# Altium project F-T-V Converter.PrjPcb
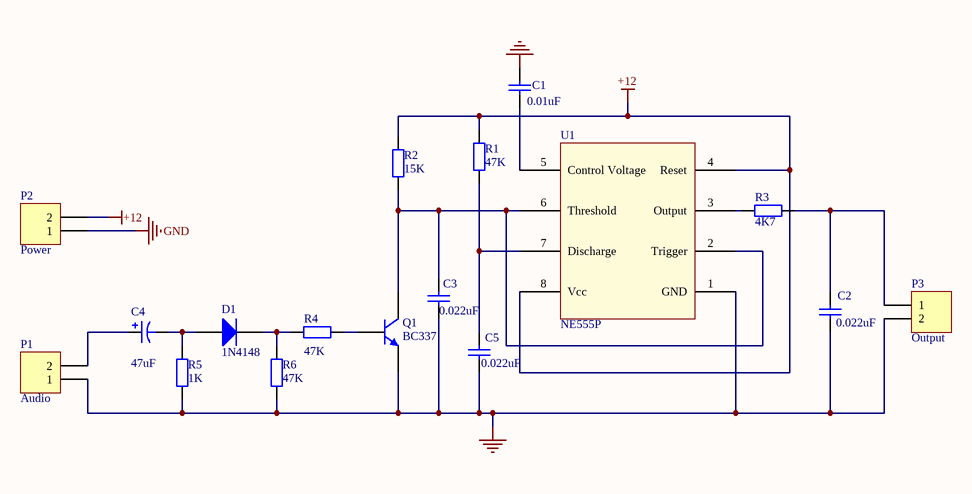
[diagram p0: F-T-V_Converter_Schematic.SchDoc]
1 sheet, 17 parts. Net scope: global (net labels, ports and power ports of the same name join across sheets).
Board file: F-T-V Converter PCB.PcbDoc

## Sheet F-T-V_Converter_Schematic.SchDoc
size A

### Parts
C1  value 0.01uF  [RAD-0.1]
C2  value 0.022uF  [RAD-0.1]
C3  value 0.022uF  [RAD-0.1]
C4  value 47uF  [RB7.6-15]
C5  value 0.022uF  [RAD-0.1]
D1  1N4148  [DO-35]
P1  Audio  [HDR1X2]
P2  Power  [HDR1X2]
P3  Output  [HDR1X2]
Q1  BC337  [TO-92]
R1  value 47K  [AXIAL-0.4]  (hidden comment: Res2)
R2  value 15K  [AXIAL-0.4]  (hidden comment: Res2)
R3  4K7  [AXIAL-0.4]
R4  value 47K  [AXIAL-0.4]  (hidden comment: Res2)
R5  value 1K  [AXIAL-0.4]
R6  value 47K  [AXIAL-0.4]  (hidden comment: Res2)
U1  NE555P  [NE555]

### Nets
+12: P2.2 R1.2 R2.2 U1.4(Reset) U1.8(Vcc)
GND: C1.2 C2.1 C3.1 C5.1 P1.1 P2.1 P3.2 Q1.3(E) R5.1 R6.1 U1.1(GND)
NetC1_1: C1.1 U1.5(Control_Voltage)
NetC2_2: C2.2 P3.1 R3.2
NetC3_2: C3.2 Q1.1(C) R2.1 U1.2(Trigger) U1.6(Threshold)
NetC4_1: C4.1 P1.2
NetC4_2: C4.2 D1.1(A) R5.2
NetC5_2: C5.2 R1.1 U1.7(Discharge)
NetD1_2: D1.2(K) R4.1 R6.2
NetQ1_2: Q1.2(B) R4.2
NetR3_1: R3.1 U1.3(Output)

### Library data of the parts
C1 = Cap: Capacitor: ceramic; MLCC, monolithic; 10nF; 100V; X7R; ±10%; THT; Manufacturer: KEMET; Manufacturer Part Number: C315C103K1R5TA; Dissipation Factor: 2.5%; Lead/Base Style: Straight; Lead Length: 7mm; Lead Diameter: 0.51mm; Published: 8-Jun-2000; LatestRevisionDate: 17-Jul-2002; LatestRevisionNote: Re-released for DXP Platform.; PackageReference: RAD-0.3; Publisher: Altium Limited; PackageDescription: Radial Cap, Thru-Hole; 2 Leads; 0.3 in Pin Spacing; Supplier 1: Digi-Key; Supplier Part Number 1: 399-4147-ND; RoHS: Yes; Category: Ceramic Capacitors; Stock 1: 32763; Pricing 1: 1=0.26000, 10=0.17800, 50=0.11880, 100=0.10100, 500=0.07128, 1000=0.06237, 2500=0.05940, 5000=0.05494 (USD); Mount: Through Hole,PCB; Case/Package: Radial; Number of Pins: 2; Dielectric Material: Ceramic; Min Operating Temperature: -55°C; Max Operating Temperature: 125°C; Capacitance: 10nF; Tolerance: 10%; Packaging: Bulk; Dielectric: X7R; Voltage Rating (DC): 100V; Voltage Rating: 100V; Package Quantity: 2500; Termination: Radial; Voltage: 100V; Series: GoldMax 300 Comm X7R; Construction: RADIAL; Length: 3.81mm; Width: 3.81mm; Height: 2.54mm; Lead Pitch: 2.54mm; Height - Seated (Max): 0.21inch; Depth: 2.54mm; Radiation Hardening: No; REACH SVHC: No SVHC; Lead Free: Lead Free; RoHS Compliant: Yes; ComponentLink1URL: https://datasheet.ciiva.com/11786/0900766b80717e24-11786801.pdf?src-supplier=RSComponents; ComponentLink1Description: https://datasheet.ciiva.com/11786/0900766b80717e24-11786801.pdf?src-supplier=RSComponents; ComponentLink2URL: https://datasheet.ciiva.com/5904/f3101-goldmax-5904939.pdf?src-supplier=Farnell; ComponentLink2Description: https://datasheet.ciiva.com/5904/f3101-goldmax-5904939.pdf?src-supplier=Farnell; ComponentLink3URL: https://datasheet.ciiva.com/18102/getdatasheetpartid-77390-18102811.pdf?src-supplier=Verical; ComponentLink3Description: https://datasheet.ciiva.com/18102/getdatasheetpartid-77390-18102811.pdf?src-supplier=Verical; ComponentLink4URL: https://datasheet.ciiva.com/39122/f3101-goldmax-39122972.pdf?src-supplier=Onlinecomponents.com; ComponentLink4Description: https://datasheet.ciiva.com/39122/f3101-goldmax-39122972.pdf?src-supplier=Onlinecomponents.com; ComponentLink5URL: https://datasheet.ciiva.com/5389/f3101-goldmax-5389838.pdf?src-supplier=Mouser; ComponentLink5Description: https://datasheet.ciiva.com/5389/f3101-goldmax-5389838.pdf?src-supplier=Mouser
C2 C3 C5 = Cap: Cap Ceramic 0.022uF 50V Z5U 20% Radial 5.08mm 85C T/R; Manufacturer: KEMET; Manufacturer Part Number: C317C223M5U5TA7301; Capacitance: 22nF; Lead/Base Style: Formed Leads; Published: 8-Jun-2000; LatestRevisionDate: 17-Jul-2002; LatestRevisionNote: Re-released for DXP Platform.; PackageReference: RAD-0.3; Publisher: Altium Limited; PackageDescription: Radial Cap, Thru-Hole; 2 Leads; 0.3 in Pin Spacing; Supplier 1: Digi-Key; Supplier Part Number 1: 399-14073-1-ND; RoHS: Yes; Category: Ceramic Capacitors; Stock 1: 5732; Pricing 1: 1=0.37000, 10=0.25100, 50=0.16720, 100=0.14210, 500=0.10032, 1000=0.08778 (USD); Mount: Through Hole; Case/Package: Radial; Min Operating Temperature: -10°C; Max Operating Temperature: 85°C; Tolerance: 20%; Dielectric: Z5U; Termination: Radial; Series: GoldMax 300 Comm Z5U; Packaging: Tape and Reel; Voltage Rating: 50V; Length: 3.8mm; Width: 2.54mm; Lead Pitch: 5.08mm; Pitch: 5.08mm; Radiation Hardening: No; RoHS Compliant: Yes; ComponentLink1URL: https://datasheet.ciiva.com/32431/c052-62-mlcc-series-eng-tds-32431014.pdf?src-supplier=Distrelec; ComponentLink1Description: https://datasheet.ciiva.com/32431/c052-62-mlcc-series-eng-tds-32431014.pdf?src-supplier=Distrelec; Supplier 2: Digi-Key; Supplier Part Number 2: 445-175388-1-ND; Stock 2: 1856; Pricing 2: 1=0.82000, 10=0.57700, 50=0.43640, 100=0.38020, 500=0.28160, 1000=0.23936 (USD)
C4 = Cap Pol1: Cap Aluminum 47uF 16V 20% Radial Aluminum Cylindrical Can 2mm 155mA 5000 hr 105°C Ammo Pack; Manufacturer: Nichicon; Manufacturer Part Number: UPV1C470MFD1TD; Impedance: 1.4R; Life (Hours): 5000Hour; Published: 8-Jun-2000; LatestRevisionDate: 17-Jul-2002; LatestRevisionNote: Re-released for DXP Platform.; PackageReference: RB7.6-15; Publisher: Altium Limited; PackageDescription: Polarized Capacitor (Radial); 2 Leads; Supplier 1: Digi-Key; Supplier Part Number 1: 493-11656-1-ND; RoHS: Yes; Category: Aluminum Electrolytic Capacitors; Stock 1: 1934; Pricing 1: 1=0.47000, 10=0.32800, 50=0.22980, 100=0.19700, 500=0.14776, 1000=0.12477 (USD); Mount: Through Hole; Case/Package: Radial; Min Operating Temperature: -55°C; Max Operating Temperature: 105°C; Package Quantity: 2000; Packaging: Tape and Reel; Capacitance: 47uF; Tolerance: 20%; Voltage Rating: 16V; Ripple Current: 155mA; Lead Pitch: 0.079inch; Height - Seated (Max): 0.492inch; RoHS Compliant: Yes; ComponentLink1URL: https://datasheet.ciiva.com/29544/e-pv-29544776.pdf?src-supplier=Digi-Key; ComponentLink1Description: https://datasheet.ciiva.com/29544/e-pv-29544776.pdf?src-supplier=Digi-Key; ComponentLink2URL: https://datasheet.ciiva.com/29544/e-pv-29544777.pdf?src-supplier=Digi-Key; ComponentLink2Description: https://datasheet.ciiva.com/29544/e-pv-29544777.pdf?src-supplier=Digi-Key
D1 = Diode 1N4148: High Conductance Fast Diode; Published: 8-Jun-2000; LatestRevisionDate: 17-Jul-2002; LatestRevisionNote: Re-released for DXP Platform.; DatasheetVersion: 1997; PackageReference: DO-35; Publisher: Altium Limited; PackageDescription: Diode, Axial; Body 3.8 x 1.9 mm (LxDia. max), Lead Dia. 0.53 mm (max); Code_JEDEC: DO-204-AH; ComponentLink1Description: Manufacturer Link; ComponentLink1URL: http://www.fairchildsemi.com/; ComponentLink2Description: Datasheet; ComponentLink2URL: http://www.fairchildsemi.com/ds/1N%2F1N4148.pdf
P1-P3 = Header 2: Header, 2-Pin; LatestRevisionDate: 17-Jul-2002; LatestRevisionNote: Re-released for DXP Platform.; Publisher: Altium Limited
Q1 = NPN: NPN Bipolar Transistor; Published: 8-Jun-2000; LatestRevisionDate: 17-Jul-2002; LatestRevisionNote: Re-released for DXP Platform.; PackageReference: TO-226-AA; Publisher: Altium Limited; PackageDescription: TO, Flat Index; 3 In-Line, Axial Leads; Body Dia. 4.8mm; Leads 0.55 x 0.51 mm (max); Code_JEDEC: TO-226-AA
R1 R2 R4-R6 = Res2: Resistor; Published: 8-Jun-2000; LatestRevisionDate: 17-Jul-2002; LatestRevisionNote: Re-released for DXP Platform.; PackageReference: AXIAL-0.4; Publisher: Altium Limited; PackageDescription: Axial Device, Thru-Hole; 2 Leads; 0.4 in Pin Spacing
R3 = Res2: RES 4.7K OHM 1/4W 5% AXIAL; Manufacturer: Stackpole Electronics; Manufacturer Part Number: CF14JT47K0; Resistance: 47kR; Power Rating: 250mW; Temperature Coefficient: 0ppm/°C; Working Voltage: 350V; Published: 8-Jun-2000; LatestRevisionDate: 17-Jul-2002; LatestRevisionNote: Re-released for DXP Platform.; PackageReference: AXIAL-0.4; Publisher: Altium Limited; PackageDescription: Axial Device, Thru-Hole; 2 Leads; 0.4 in Pin Spacing; Value: 4K7; Supplier 1: Digi-Key; Supplier Part Number 1: CF14JT47K0CT-ND; RoHS: Yes; Category: Through-Hole Resistors; Stock 1: 174171; Pricing 1: 1=0.10000, 10=0.03600, 25=0.02640, 50=0.02000, 100=0.01480, 250=0.01124, 500=0.00900, 1000=0.00662 (USD); Mount: Through Hole,Axial; Case/Package: Conformal; Contact Plating: Tin,Matte; Min Operating Temperature: -55°C; Max Operating Temperature: 155°C; Packaging: Tape and Reel; Tolerance: 5%; Package Quantity: 1; Resistor Type: Carbon Film; Number of Terminations: 2; Termination: Axial; Max Power Dissipation: 250mW; Features: Flame Retardant Coating; Series: CF; Construction: Cylindrical; Technology: CARBON FILM; Diameter: 2.3mm; Length: 6.5mm; Radiation Hardening: No; Military Standard: Not; Lead Free: Lead Free; RoHS Compliant: Yes; ComponentLink1URL: https://www.verical.com/server-webapp/html/getDatasheet?partID=364248&src-supplier=Verical; ComponentLink1Description: https://www.verical.com/server-webapp/html/getDatasheet?partID=364248&src-supplier=Verical; ComponentLink2URL: https://www.seielect.com/catalog/SEI-CF_CFM.pdf?src-supplier=Avnet; ComponentLink2Description: https://www.seielect.com/catalog/SEI-CF_CFM.pdf?src-supplier=Avnet; ComponentLink3URL: http://www.seielect.com/Catalog/SEI-CF_CFM.pdf?src-supplier=Future+Electronics; ComponentLink3Description: http://www.seielect.com/Catalog/SEI-CF_CFM.pdf?src-supplier=Future+Electronics; ComponentLink4URL: https://www.seielect.com/catalog/SEI-Packaging.pdf?src-supplier=Digi-Key; ComponentLink4Description: https://www.seielect.com/catalog/SEI-Packaging.pdf?src-supplier=Digi-Key; ComponentLink5URL: http://components.arrow.com/part/dataview/27620275S9848655N1174?src-supplier=Arrow+Electronics; ComponentLink5Description: http://components.arrow.com/part/dataview/27620275S9848655N1174?src-supplier=Arrow+Electronics; Supplier 2: Digi-Key; Supplier Part Number 2: CF14JT4K70CT-ND; Stock 2: 247552; Pricing 2: 1=0.10000, 10=0.03600, 25=0.02640, 50=0.02000, 100=0.01480, 250=0.01124, 500=0.00900, 1000=0.00662 (USD); ComponentLink6URL: https://datasheet.ciiva.com/15215/getdatasheetpartid-360405-15215963.pdf?src-supplier=Verical; ComponentLink6Description: https://datasheet.ciiva.com/15215/getdatasheetpartid-360405-15215963.pdf?src-supplier=Verical
U1 = NE555P: Standard Timer Single 8-Pin PDIP Tube; Manufacturer: Texas Instruments; Frequency: 500kHz; Quiescent Current: 15mA; Operating Supply Current: 10mA; High Level Output Current: -200mA; Low Level Output Current: 200mA; Min Supply Voltage: 4.5V; Max Supply Voltage: 16V; Nominal Supply Current: 2mA; Number of Timers/Counters: 1; Operating Supply Voltage: 5V; Supplier 1: Mouser; Manufacturer Part Number: NE555P; RoHS: Yes; Category: Clock and Timing; Stock 1: 1667; Pricing 1: 1=0.37000, 10=0.29900, 50=0.29900, 100=0.20300, 1000=0.11400, 10000=0.09800 (USD); Mount: Through Hole; Case/Package: PDIP; Number of Pins: 8; Weight: 0.015535oz; Contact Plating: Gold; Min Operating Temperature: 0°C; Max Operating Temperature: 70°C; Packaging: Rail/Tube; Package Quantity: 50; Current Rating: 10mA; Length: 9.81mm; Width: 6.35mm; Height: 4.57mm; Radiation Hardening: No; Lead Free: Lead Free; RoHS Compliant: Yes; REACH SVHC: No SVHC; ComponentLink1URL: https://datasheet.ciiva.com/1139/sa555-1139904.pdf?src-supplier=Element14; ComponentLink1Description: https://datasheet.ciiva.com/1139/sa555-1139904.pdf?src-supplier=Element14; ComponentLink2URL: https://datasheet.ciiva.com/19457/904085-19457361.pdf?src-supplier=Jameco; ComponentLink2Description: https://datasheet.ciiva.com/19457/904085-19457361.pdf?src-supplier=Jameco; ComponentLink3URL: https://datasheet.ciiva.com/26325/152184-da-01-en-ne555p-timer-tid-26325915.pdf?src-supplier=Conrad; ComponentLink3Description: https://datasheet.ciiva.com/26325/152184-da-01-en-ne555p-timer-tid-26325915.pdf?src-supplier=Conrad; ComponentLink4URL: https://datasheet.ciiva.com/1147/1764032-1147750.pdf?src-supplier=Newark; ComponentLink4Description: https://datasheet.ciiva.com/1147/1764032-1147750.pdf?src-supplier=Newark; ComponentLink5URL: https://datasheet.ciiva.com/14094/ne555-series-eng-tds-14094950.pdf?src-supplier=Distrelec; ComponentLink5Description: https://datasheet.ciiva.com/14094/ne555-series-eng-tds-14094950.pdf?src-supplier=Distrelec; ComponentLink6URL: https://datasheet.ciiva.com/14274/ne555-14274456.pdf?src-supplier=Avnet; ComponentLink6Description: https://datasheet.ciiva.com/14274/ne555-14274456.pdf?src-supplier=Avnet; ComponentLink7URL: https://datasheet.ciiva.com/15152/getdatasheetpartid-248510-15152620.pdf?src-supplier=Verical; ComponentLink7Description: https://datasheet.ciiva.com/15152/getdatasheetpartid-248510-15152620.pdf?src-supplier=Verical; ComponentLink8URL: https://datasheet.ciiva.com/1233/ne555-1233454.pdf?src-supplier=Digi-Key; ComponentLink8Description: https://datasheet.ciiva.com/1233/ne555-1233454.pdf?src-supplier=Digi-Key; ComponentLink9URL: https://datasheet.ciiva.com/26228/ne555-26228892.pdf?src-supplier=Avnet+Europe; ComponentLink9Description: https://datasheet.ciiva.com/26228/ne555-26228892.pdf?src-supplier=Avnet+Europe; Supplier Part Number 1: 595-NE555P